# Altium schematic sheet Power.SchDoc
size A4; SheetNumber: 2; SheetTotal: 2
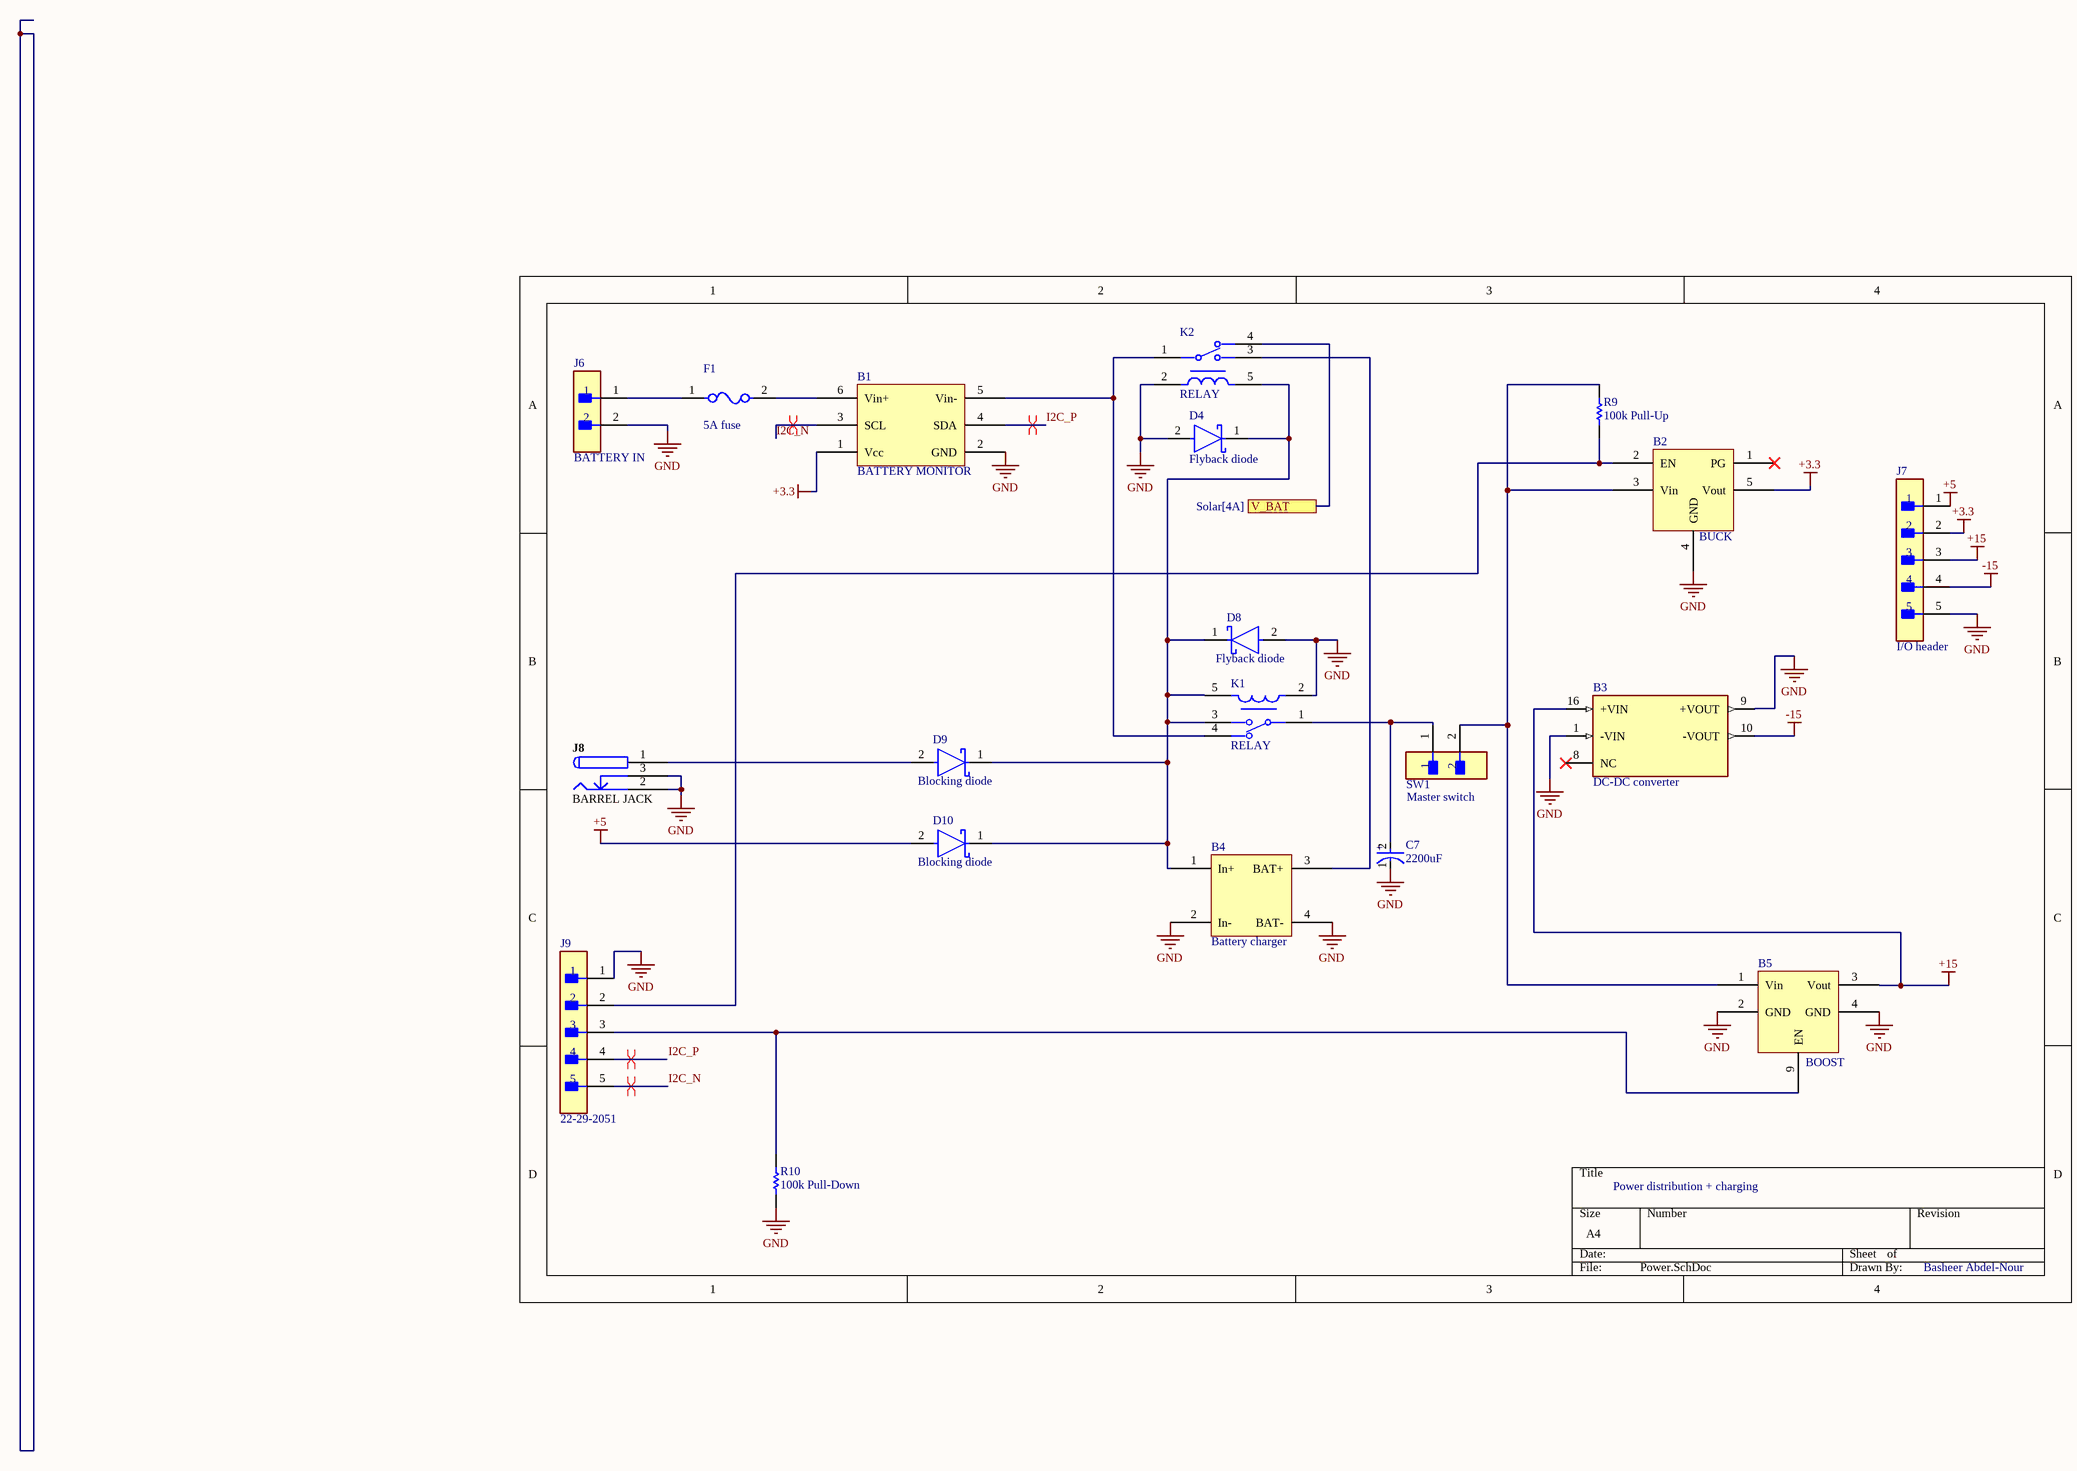
[diagram p0: Power.SchDoc]

## Parts
B1  BATTERY MONITOR  [Adafruit 904]
B2  BUCK  [Pololu Buck converter]
B3  DC-DC converter  [DC-DC converter]
B4  Battery charger  [Battery charger]
B5  BOOST  [Pololu boost converter]
C7  2200uF  [FP-RAD-TH-D_16_0_5-L_25_2-MFG]
D4  Flyback diode  [FP-DO-201AD-MFG]
D8  Flyback diode  [FP-DO-201AD-MFG]
D9  Blocking diode  [FP-DO-201AD-MFG]
D10  Blocking diode  [FP-DO-201AD-MFG]
F1  5A fuse  [FP-0PTF0078P-MFG]
J6  BATTERY IN  [FP-26-61-4020-MFG]
J7  I/O header  [FP-26-60-4050-MFG]
J8  BARREL JACK  [KYCN-KLDX-0202-B_V]
J9  22-29-2051  [FP-22-29-2051-MFG]
K1  RELAY  [FP-G5LE-1-E_DC5-MFG]
K2  RELAY  [FP-G5LE-1-E_DC5-MFG]
R9  100k Pull-Up  [RESA60-630X240]
R10  100k Pull-Down  [RESA60-630X240]
SW1  Master switch  [FP-26-61-4020-MFG]

## Ports
V_BAT (see Solar[4A])

## Nets
+3.3: B1.1(Vcc) B2.5(Vout) J7.2
+5: D10.2(A) J7.1
+15: B3.16(+VIN) B5.3(Vout) J7.3
-15: B3.10(-VOUT) J7.4
GND: B1.2(GND) B2.4(GND) B3.1(-VIN) B3.9(+VOUT) B4.2(In-) B4.4(BAT-) B5.2(GND) B5.4(GND) C7.1(C) D4.2(A) D8.2(A) J6.2 J7.5 J8.2 J8.3 J9.1 K1.2 K2.2 R10.1
I2C_N: B1.3(SCL) J9.5
I2C_P: B1.4(SDA)
V_BAT: K2.4 ; port V_BAT
NetB1_5: B1.5(Vin-) K1.4 K2.1
NetB1_6: B1.6(Vin+) F1.2
NetB2_2: B2.2(EN) J9.2 R9.1
NetB2_3: B2.3(Vin) B5.1(Vin) R9.2 SW1.2
NetB4_1: B4.1(In+) D4.1(C) D8.1(C) D9.1(C) D10.1(C) K1.3 K1.5 K2.5
NetB4_3: B4.3(BAT+) K2.3
NetB5_9: B5.9(EN) J9.3 R10.2
NetC7_2: C7.2(A) K1.1 SW1.1
NetD9_2: D9.2(A) J8.1
NetF1_1: F1.1 J6.1

Not connected (* = marked no-connect by the designer): B2 1(PG)*; B3 8(NC)*; J9 4

## Layout directives
differential pair: I2C_N, I2C_P, NetJ9_4

## Notes on the sheet
- Power distribution + charging
- Basheer Abdel-Nour
- Labels drawn without touching a wire or pin: I2C_P
- (in symbol CMP-05427-000889-1) +

## Library data of the parts
B1 = Adafruit 904
B2 = Pololu_buck
B5 = Pololu_boost
C7 = CMP-05427-000889-1: Aluminum Electrolytic Capacitors (Radial Lead Type) AEC-Q200 Qualified 2200uF ±20% 25V; Outside Diameter: 16mm; Lead/Base Style: Straight; Leakage Current: 550uA; ESR (Equivalent Series Resistance): 22mR; Capacitance: 2.2mF; Life (Hours): 2000Hour; Ripple Current (AC): 2.76A; Ripple Current: 2.3A; Lead Diameter: 0.8mm; Voltage Rating (DC): 25V; Lead Pitch: 7.5mm; Construction: RADIAL; Tolerance: 20%; Mount: Through Hole; Number of Pins: 2; Min Operating Temperature: -40°C; Package Quantity: 100; Radiation Hardening: No; Height: 25mm; RoHS Compliant: Yes; Termination: Radial; Voltage Rating: 25V; Diameter: 16mm; Packaging: Bulk; Case/Package: Radial; Series: TP; Voltage: 25V; Length: 25mm; Max Operating Temperature: 135°C; Height - Seated (Max): 1.063inch; REACH SVHC: No SVHC
D4 D8-D10 = CMP-12187-000025-1: DIODE SCHOTTKY 40V 3A DO201AD; Manufacturer Part Number: 1N5822; Manufacturer: STMicroelectronics; Max Junction Temp: +150°C; Peak Reverse Current: 2mA; Max Surge Forward Current: 80A; Temperature Range High: +150°C; Automotive: No; RoHS: TRUE; ComponentLink2Description: Datasheet; Lead Free: Yes; Octopart: https://octopart.com/1n5822-stmicroelectronics-323225; Device Class L2: Diodes; Max Repetitive Reverse Voltage: 40V; Temperature: to +150°C; Height: 5.3mm; Category: Diode; Digikey Description: DIODE SCHOTTKY 40V 3A DO201AD; ComponentLink2URL: https://www.st.com/resource/en/datasheet/1n5822.pdf; Device Class L3: Schottky Diodes; Device Class L1: Discrete Semiconductors; Forward Current: 3A; Mouser Description: Schottky Diodes & Rectifiers Vr/40V Io/3A BULK; Package: DO-201AD
F1 = CMP-08604-000023-1: FUSE BLOCK CARTRIDGE PCB; Manufacturer Part Number: 0PTF0078P; Manufacturer: Littelfuse Inc; Number Of Fuses: 1; Conn Orientation: Vertical; Fuse Current: 6.3A; Voltage Rating Ac: 250V; Package: 0; Ambient Temperature Range Low: -30°C; ComponentLink2URL: https://media.digikey.com/pdf/Data%20Sheets/Littelfuse%20PDFs/PTF075_77_78.pdf; Device Class L3: unset; Lead Free: Yes; Device Class L1: Circuit Protection; RoHS: TRUE; Ambient Temperature Range High: +85°C; Category: Fuse; Octopart: https://octopart.com/0ptf0078p-littelfuse-13255855; Digikey Description: FUSE BLOCK CARTRIDGE PCB; Height: 11.5mm; ComponentLink2Description: Datasheet; Device Class L2: Fuse Holders; Mouser Description: Fuse Holder 5X20MM Pitch 22/7 UL94V0 Open; Automotive: No; Voltage Rating Dc: 250V
J6 SW1 = CMP-00257-00277943-1: 26-61-4020 3.96mm (.156") Pitch KK® Solid Header, Vertical, Friction Lock, 2 Circuits, Gold (Au) Plating; NexarPartId: 277943; Manufacturer Lifecycle Status: ACTIVE; Number of Positions: 2; Contact Resistance: 6mΩ; Voltage Rating (DC): 250V; Glow Wire Compliant: Non-compliant; Max Current Rating: 7A; Insulation Resistance: 50GΩ; Gender: Male; Pitch: 3.96mm; Orientation: Right Angle, Vertical; Number of Circuits: 2; Length: 7.77mm; Depth: 10.01mm; Min Operating Temperature: 0°C; Mount: Through Hole; Lifecycle Status: Production; Lead Pitch: 3.96mm; Packaging: Bulk; Voltage Rating: 250V; Flammability Rating: UL94 V-0; Schedule B: 8536694040; Country of Origin: US; Contact Plating: Gold; Housing Color: Natural; Lead Free: Lead Free; Housing Material: Polyester; RoHS: Compliant; Color: Natural; Contact Material: Brass; REACH SVHC: Unknown; Number of Contacts: 2; Number of Rows: 1; Height: 14.73mm; Current Rating: 7A; Termination: Solder; Max Operating Temperature: 75°C; Max Voltage Rating (AC): 250V; Radiation Hardening: No
J7 = CMP-04776-000344-1: CONN HEADER VERT 5POS 3.96MM; Voltage Rating: 250V; Insulation Resistance: 50GR; Number of Lines: 1; Number of Positions: 5; Approvals: UL; Gender: Male; Glow Wire Compliant: Non-compliant; Contact Resistance: 6mR; Current Rating: 7A; Housing Color: Natural; Pitch: 3.96mm; Color: Natural; Contact Material: Brass; Flammability Rating: UL94 V-0; Contact Gender: Male; Number of Rows: 1; Max Operating Temperature: 75°C; Radiation Hardening: No; Series: KK® 41791; Voltage Rating (DC): 250V; Contact Mating Length: 0.45inch; Lead Free: Lead Free; Mount: Through Hole; Housing Material: Polyester; Orientation: Straight; Contact Plating: Tin; Min Operating Temperature: 0°C; Contact Type: Male Pin; Fastening Type: Friction; Material: Polyester; Termination: Solder; Number of Poles: 5; Depth: 10.01mm; RoHS Compliant: Yes; Package Quantity: 400; Number of Circuits: 5; Packaging: Bulk; Max Voltage Rating (AC): 250V; Number of Contacts: 5
J8 = CMP-0256-00001-1: 3 Conductor Power Jack, 2 break 2 aux contacts; PartNumber: KLDX-0202-B; ComponentLink2URL: http://anacapa.kycon.com/Catalog_PDF/KLDX_0202.pdf; PackageReference: KLDX-0202-B; Contact Finish: Brass; ComponentLink2Description: Datasheet; Mounting Technology: Through Hole; PackageDescription: Jack, 9 x 14.5 mm Body, 2.5 mm Center Pin Diameter; ComponentLink1Description: Manufacturer URL; ComponentLink1URL: http://kycon.com/
J9 = CMP-04776-000816-1: 2.54MM KK HDR VT FRICLK VRA .5AU; Number of Circuits: 5; Connector Type: Male Pin; Max Current Rating: 7A; Glow Wire Compliant: Non-compliant; Insulation Resistance: 50GR; Gender: Male; Current Rating: 4A; Number of Lines: 1; Max Voltage Rating (AC): 250V; Contact Resistance: 10mR; Orientation: Straight; Height: 14.73mm; Contact Plating: Gold; Series: KK® 6410; Number of Poles: 5; Mount: Through Hole; Length: 12.7mm; Packaging: Bulk; Package Quantity: 10; Depth: 5.8mm; Housing Color: White; Pitch: 2.54mm; Number of Positions: 5; Contact Mating Length: 0.295inch; Max Operating Temperature: 75°C; Housing Material: Nylon; Termination: Solder; Contact Material: Brass; Flammability Rating: UL94 V-0; Number of Contacts: 5; Color: Natural; Min Operating Temperature: 0°C; Radiation Hardening: No; Contact Type: Male Pin; Number of Rows: 1; Voltage Rating: 250V; Voltage Rating (DC): 250V; Contact Gender: Male; Fastening Type: Friction; Lead Free: Lead Free; Halogen Free: Low Halogen
K1 K2 = CMP-08822-000286-1: RELAY GEN PURPOSE SPDT 16A 5V; Power Consumption: 400mW; Coil Resistance: 63R; Coil Type: Non-Latching; Release Time: 5ms; Max Voltage Rating (AC): 250V; Relay Type: General Purpose; Life (Hours): 1000000Hour; Coil Current: 79.4mA; Operate Time: 10ms; Packaging: Rail/Tube; Lead Free: Lead Free; Throw Configuration: SPDT; Termination: Solder; Height: 19mm; Series: G5LE; RoHS Compliant: Yes; Min Operating Temperature: -25°C; Package Quantity: 100; Width: 16.5mm; Contact Material: Tin; Length: 22.5mm; Coil Power: 400mW; Coil Voltage (DC): 5V; Depth: 16.5mm; Radiation Hardening: No; Max Current Rating: 16A; Contact Current Rating: 16A; Weight: 12g; Max Operating Temperature: 85°C; Number of Pins: 5; Mount: PCB
R9 R10 = CMP-1659-00073-1: Axial Resistor, 100 KOhm, +/- 1%, 0.25 W, -55 to 155 degC, 2-Pin THD, RoHS, Bulk; Voltage Rating: 250 V; Power Rating: 250 mW; Resistance: 475 Ohm; PackageDescription: 2-Pin Axial Lead, Dia 2.4 mm, Body Length 6.3 mm; PackageReference: MFR-25; Length: 0.248 inch; ComponentLink2Description: Datasheet; Packaging: Bulk; DatasheetVersion: Apr-13; Package Quantity: 200; Min Operating Temperature: -55 degC; ComponentLink2URL: http://www.yageo.com/documents/recent/Yageo%20LR_MFR_2013.pdf; RoHSCompliant: true; ComponentLink1URL: http://www.yageo.com/; Tolerance: 1%; Case\Package: Axial; Mount: Through Hole; ComponentLink1Description: Manufacturer URL; Max Operating Temperature: 155 degC